# EAGLE design nunchuk (EAGLE 5.10)
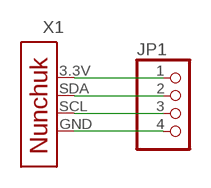
[diagram p0: schematic, sheet 1]

## Parts
JP1  PINHD-1X4  [1X04]
X1  NUNCHUK  [NUNCHUK]

## Nets
N$1: JP1.1 X1.3.3V(3.3)
N$2: JP1.2 X1.SDA
N$3: JP1.3 X1.SCL
N$4: JP1.4 X1.GND

## Library data of the parts
JP1 = ccard:PINHD-1X4: PIN HEADER
X1 = nunchuk:NUNCHUK

## Board
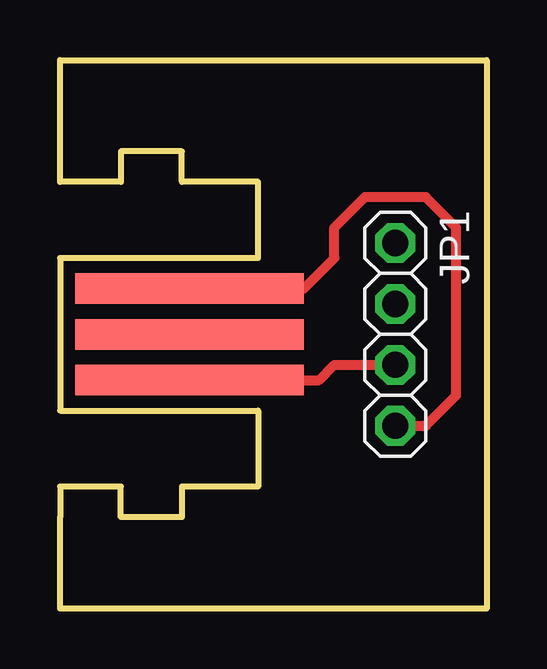
[diagram p1: board, top side]
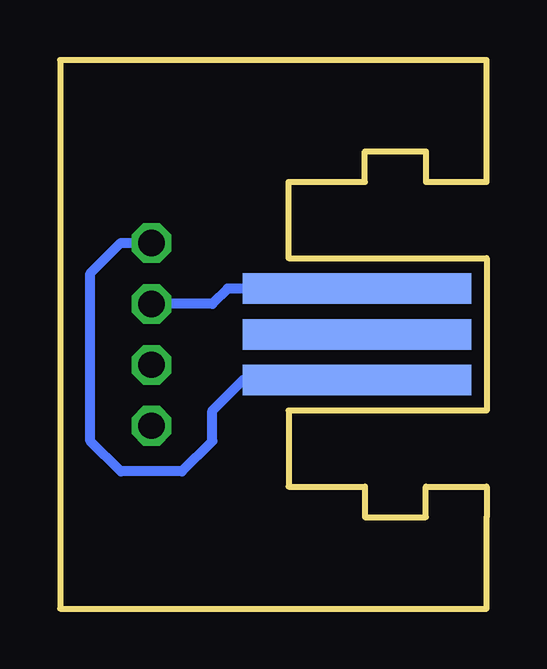
[diagram p2: board, bottom side, seen from below]

Size 17.78 x 22.86 mm. Coordinates in mm from the lower left corner, seen from the top.
Outline: 0,19.05 0,22.86 17.78,22.86 17.78,0 0,0 0,3.81
Copper layers (1*16): Top 0.035mm / dielectric 1.5mm / Bottom 0.035mm
Design rules "default": minimum track width 10mil, minimum drill 24mil, track to track 8mil, track to pad 8mil, pad to pad 8mil, via to via 8mil, smd to smd 8mil, copper to edge 40mil, drill to drill 8mil, minimum pad ring 10mil, minimum via ring 8mil, stop-mask expansion 4mil, vias tented up to drill 0mil, thermal gap 10mil

### Footprints (pad centres in the part's own frame; a part is rotated, then mirrored left to right if it is on the bottom)
1X04 = drill 1.1 octagon: 1 -3.81,0; 2 -1.27,0; 3 1.27,0; 4 3.81,0
NUNCHUK = smd 1.27 x 9.525 bottom: 3.3V 1.905,5.397; DDT 0,5.397; SDA -1.905,5.397 | smd 1.27 x 9.525: GND -1.905,5.397; NC 0,5.397; SCL 1.905,5.397

### Placement (x,y rotation side)
JP1  13.97,11.43 270 top
X1  0,11.43 270 top

### Tracks (layer width: path | path; a pad name or v marks a point on that pad's centre or on a via)
N$1
  Bottom 0.406: JP1.1 15.24,15.24 16.51,13.97 16.51,6.99 15.24,5.71 12.7,5.71 11.43,6.99 11.43,8.26 10.16,9.53 X1.3.3V
N$2
  Bottom 0.406: X1.SDA 10.8,13.34 11.43,12.7 JP1.2
N$3
  Top 0.406: X1.SCL 10.8,9.53 11.43,10.16 JP1.3
N$4
  Top 0.406: JP1.4 15.24,7.62 16.51,8.89 16.51,15.88 15.24,17.14 12.7,17.14 11.43,15.88 11.43,14.61 10.16,13.34 X1.GND